# EAGLE schematic ds1_redraw (EAGLE 8.7.0)
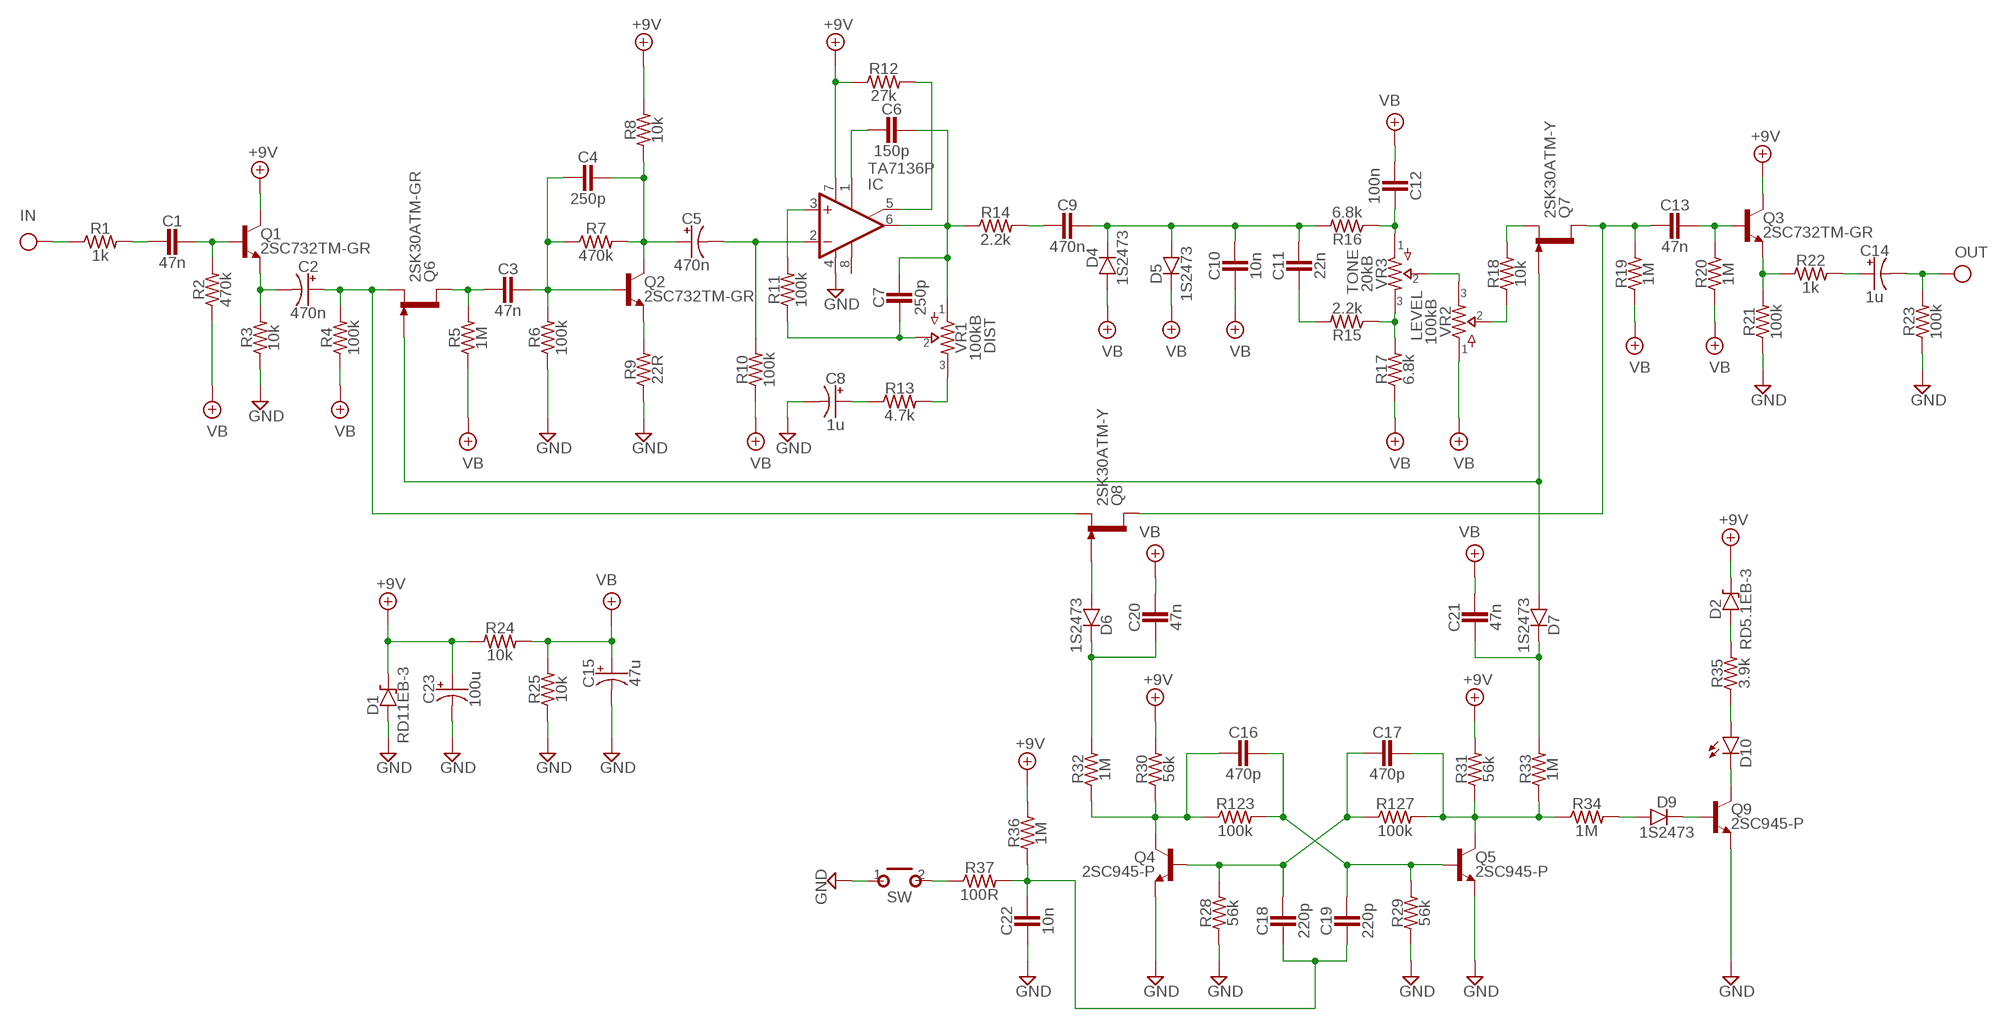
[diagram p0: schematic, sheet 1]

## Parts
C1  47n  CER/FILMBOX.1  [BOX_SMALL]
C2  470n  0400  [040_020]
C3  47n  CER/FILMBOX.1  [BOX_SMALL]
C4  250p  CER/FILMBOX.1  [BOX_SMALL]
C5  470n  0400  [040_020]
C6  150p  CER/FILMBOX.1  [BOX_SMALL]
C7  250p  CER/FILMBOX.1  [BOX_SMALL]
C8  1u  0400  [040_020]
C9  470n  CER/FILMBOX.1  [BOX_SMALL]
C10  10n  CER/FILMBOX.1  [BOX_SMALL]
C11  22n  CER/FILMBOX.1  [BOX_SMALL]
C12  100n  CER/FILMBOX.1  [BOX_SMALL]
C13  47n  CER/FILMBOX.1  [BOX_SMALL]
C14  1u  0400  [040_020]
C15  47u  0400  [040_020]
C16  470p  CER/FILMBOX.1  [BOX_SMALL]
C17  470p  CER/FILMBOX.1  [BOX_SMALL]
C18  220p  CER/FILMBOX.1  [BOX_SMALL]
C19  220p  CER/FILMBOX.1  [BOX_SMALL]
C20  47n  CER/FILMBOX.1  [BOX_SMALL]
C21  47n  CER/FILMBOX.1  [BOX_SMALL]
C22  10n  CER/FILMBOX.1  [BOX_SMALL]
C23  100u  0400  [040_020]
D1  RD11EB-3  ZENER.2  [DO41-2]
D2  RD5.1EB-3  ZENER.2  [DO41-2]
D4  1S2473  DO35.2  [DO35-2]
D5  1S2473  DO35.2  [DO35-2]
D6  1S2473  DO35.2  [DO35-2]
D7  1S2473  DO35.2  [DO35-2]
D9  1S2473  DO35.2  [DO35-2]
D10  SLP1358  LED  [3MM_D]
IC  TA7136P  SINGLETH  [DIL0]
Q1  2SC732TM-GR  2SC828A  [TO92-]
Q2  2SC732TM-GR  2SC828A  [TO92-]
Q3  2SC732TM-GR  2SC828A  [TO92-]
Q4  2SC945-P  2SC828A  [TO92-]
Q5  2SC945-P  2SC828A  [TO92-]
Q6  2SK30ATM-GR  2N3819TO-92S  [TO92-]
Q7  2SK30ATM-Y  2N3819TO-92S  [TO92-]
Q8  2SK30ATM-Y  2N3819TO-92S  [TO92-]
Q9  2SC945-P  2SC828A  [TO92-]
R1  1k  R_.3B  [R0207/3]
R2  470k  R_.3B  [R0207/3]
R3  10k  R_.3B  [R0207/3]
R4  100k  R_.3B  [R0207/3]
R5  1M  R_.3B  [R0207/3]
R6  100k  R_.3B  [R0207/3]
R7  470k  R_.3B  [R0207/3]
R8  10k  R_.3B  [R0207/3]
R9  22R  R_.3B  [R0207/3]
R10  100k  R_.3B  [R0207/3]
R11  100k  R_.3B  [R0207/3]
R12  27k  R_.3B  [R0207/3]
R13  4.7k  R_.3B  [R0207/3]
R14  2.2k  R_.3B  [R0207/3]
R15  2.2k  R_.3B  [R0207/3]
R16  6.8k  R_.3B  [R0207/3]
R17  6.8k  R_.3B  [R0207/3]
R18  10k  R_.3B  [R0207/3]
R19  1M  R_.3B  [R0207/3]
R20  1M  R_.3B  [R0207/3]
R21  100k  R_.3B  [R0207/3]
R22  1k  R_.3B  [R0207/3]
R23  100k  R_.3B  [R0207/3]
R24  10k  R_.3B  [R0207/3]
R25  10k  R_.3B  [R0207/3]
R28  56k  R_.3B  [R0207/3]
R29  56k  R_.3B  [R0207/3]
R30  56k  R_.3B  [R0207/3]
R31  56k  R_.3B  [R0207/3]
R32  1M  R_.3B  [R0207/3]
R33  1M  R_.3B  [R0207/3]
R34  1M  R_.3B  [R0207/3]
R35  3.9k  R_.3B  [R0207/3]
R36  1M  R_.3B  [R0207/3]
R37  100R  R_.3B  [R0207/3]
R123  100k  R_.3B  [R0207/3]
R127  100k  R_.3B  [R0207/3]
SW  MOMENTARY  [SPST]
VR1  100kB  POTS16MM  [16MM]
VR2  100kB  POTS16MM  [16MM]
VR3  20kB  POTS16MM  [16MM]

## Nets
+9V: C23.+ D1.C D2.C IC.7(V+) Q1.2(C) Q3.2(C) R8.2 R12.1 R24.1 R30.2 R31.2 R36.2
GND: C8.- C15.- C22.2 C23.- D1.A IC.4(V-) Q4.3(E) Q5.3(E) Q9.3(E) R3.1 R6.1 R9.1 R21.1 R23.1 R25.1 R28.1 R29.1 SW.1(P)
IN: R1.1
N$1: C11.2 R15.2
N$2: C12.1 R16.1 VR3.1
N$3: C1.2 R1.2
N$4: C1.1 Q1.1(B) R2.2
N$5: C3.2 Q6.3(D) R5.2
N$7: C2.- Q1.3(E) R3.2
N$8: C2.+ Q6.1(S) Q8.1(S) R4.2
N$9: C3.1 C4.2 Q2.1(B) R6.2 R7.1
N$10: Q2.3(E) R9.2
N$11: C4.1 C5.+ Q2.2(C) R7.2 R8.1
N$12: C5.- IC.2(-IN) R10.2
N$13: IC.5(ON2) R12.2
N$14: C6.2 IC.1(ON1)
N$15: C6.1 C7.1 IC.6(OUT) R14.1 VR1.1
N$16: IC.3(+IN) R11.2
N$17: C7.2 R11.1 VR1.2
N$19: C8.+ R13.1
N$20: R13.2 VR1.3
N$21: C9.2 R14.2
N$22: C9.1 C10.1 C11.1 D4.C D5.A R16.2
N$23: R15.1 R17.2 VR3.3
N$25: VR2.3 VR3.2
N$26: R18.1 VR2.2
N$29: C16.2 Q4.2(C) R30.1 R32.1 R123.1
N$31: C17.1 Q5.2(C) R31.1 R33.1 R34.1 R127.2
N$32: C17.2 C18.1 Q4.1(B) R28.2 R127.1
N$33: Q7.1(S) R18.2
N$34: C16.1 C19.1 Q5.1(B) R29.2 R123.2
N$35: C18.2 C19.2 C22.1 R36.1 R37.2
N$36: C21.2 D7.C R33.2
N$37: D6.A Q8.2(G)
N$38: C20.2 D6.C R32.2
N$39: D7.A Q6.2(G) Q7.2(G)
N$40: C13.2 Q7.3(D) Q8.3(D) R19.2
N$41: C13.1 Q3.1(B) R20.2
N$42: D10.ANODE(A) R35.1
N$43: D2.A R35.2
N$44: Q3.3(E) R21.2 R22.1
N$45: C14.+ R22.2
N$47: D10.P$1(C) Q9.2(C)
N$48: D9.A R34.2
N$49: R37.1 SW.2(S)
N$50: D9.C Q9.1(B)
OUT: C14.- R23.2
VB: C10.2 C12.2 C15.+ C20.1 C21.1 D4.A D5.C R2.1 R4.1 R5.1 R10.1 R17.1 R19.1 R20.1 R24.2 R25.2 VR2.1
Unconnected: IC.8(OPT)

## Notes on the sheet
- TONE
- LEVEL
- DIST

## Library data of the parts
C1 C3 C4 C6 C7 C9-C13 C16-C22 = pedals-capacitors-film:CER/FILM: 47 - 120pF Xicon Ceramic Disc 2.5mm lead spacing
C2 C5 C8 C14 C15 C23 = pedals-capacitors-elec:040
D1 D2 = pedals-diodes:ZENER
D4-D7 D9 = pedals-diodes:DO35: DO-35 Package Diodes: 1N914
D10 = pedals-diodes:LED
IC = pedals-integrated circuits:SINGLE: OP AMP
Q1-Q5 Q9 = pedals-transistors:2SC828A
Q6-Q8 = pedals-transistors:2N3819: N-CHANNEL FET
R1-R25 R28-R37 R123 R127 = pedals-resistors:R_
SW = pedals-switches:MOMENTARY
VR1-VR3 = pedals-potentiometers:POTS